# Altium schematic sheet Title Page.SchDoc: Title Page
size A; Organization: UOE Racing; Address1: University of Ottawa; Address2: Camry M; Address3: &; Address4: Nick M; DocumentNumber: 2020; Revision: A; SheetNumber: 1; SheetTotal: 4
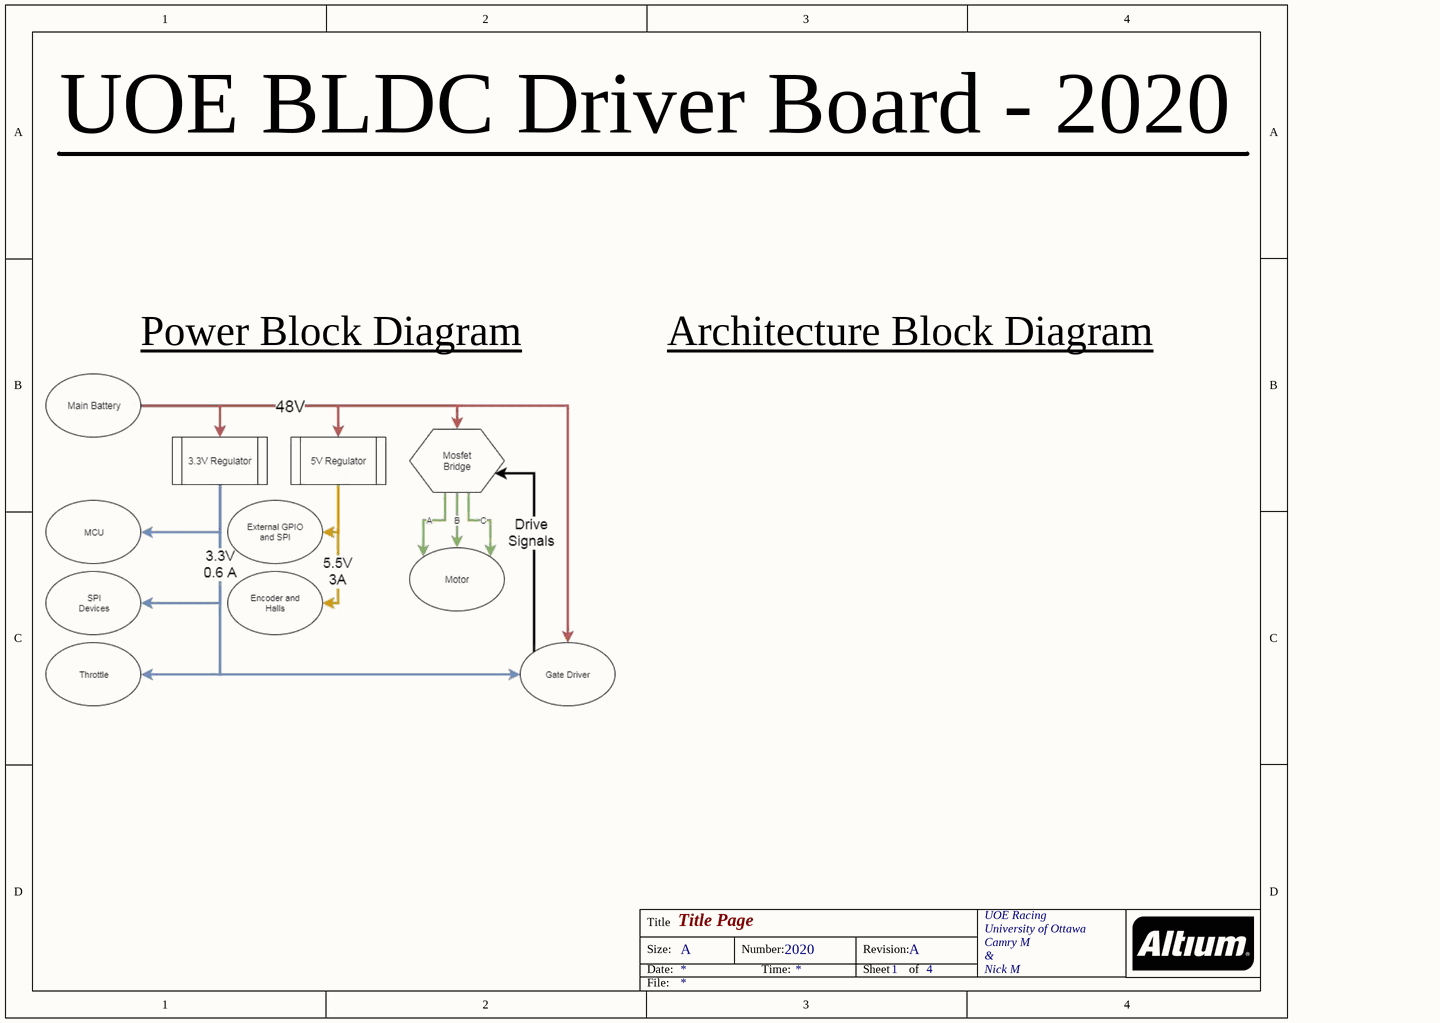
[diagram p0: Title Page.SchDoc]

## Notes on the sheet
- UOE BLDC Driver Board - 2020
- Power Block Diagram
- Architecture Block Diagram
- Title
- Size:
- Date:
- A
- Number:
- Time:
- Revision:
- Sheet
- of
- File: